# Altium schematic sheet GTM_UARTconnector.SchDoc
size A4
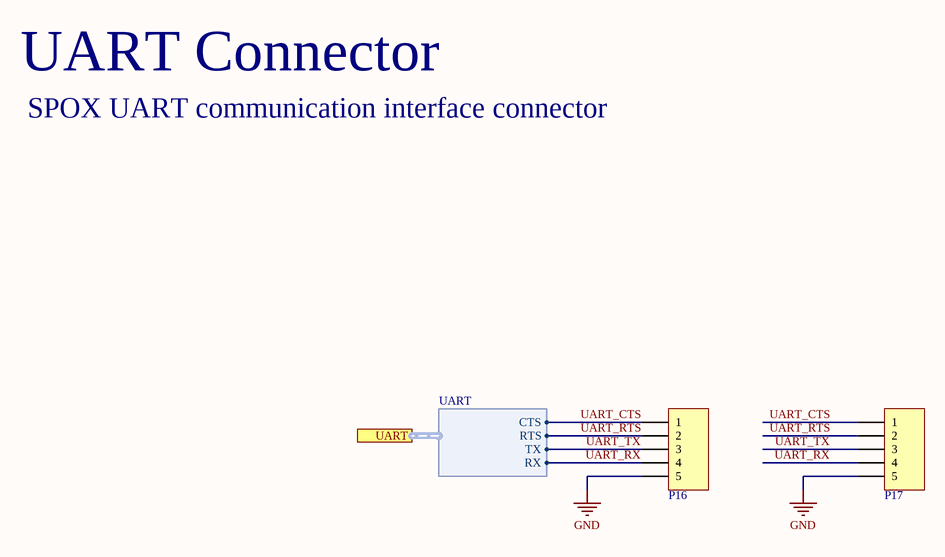
[diagram p0: GTM_UARTconnector.SchDoc]

## Parts
P16  HDR1X5  [Molex SPOX Horizontal 5 Circuits]  (value not drawn)
P17  HDR1X5  [Molex SPOX Horizontal 5 Circuits]  (value not drawn)

## Ports
UART (harness UART)

## Harnesses
UART: CTS, RTS, TX, RX

## Nets
GND: P16.5 P17.5
UART_CTS: P16.1 P17.1 ; port UART.CTS
UART_RTS: P16.2 P17.2 ; port UART.RTS
UART_RX: P16.4 P17.4 ; port UART.RX
UART_TX: P16.3 P17.3 ; port UART.TX

## Notes on the sheet
- UART Connector
- SPOX UART communication interface connector
- Project
- Rev.
- Title
- Drawn by
- Date
- Sheet
- of
- Checked by

## Library data of the parts
P16 = HDR1X5: Header, 5-Pin; LatestRevisionDate: 17-Jul-2002; LatestRevisionNote: Re-released for DXP Platform.; Publisher: Altium Limited
P17 = HDR1X5: Doubled Connector; LatestRevisionDate: 17-Jul-2002; LatestRevisionNote: Re-released for DXP Platform.; Publisher: Altium Limited